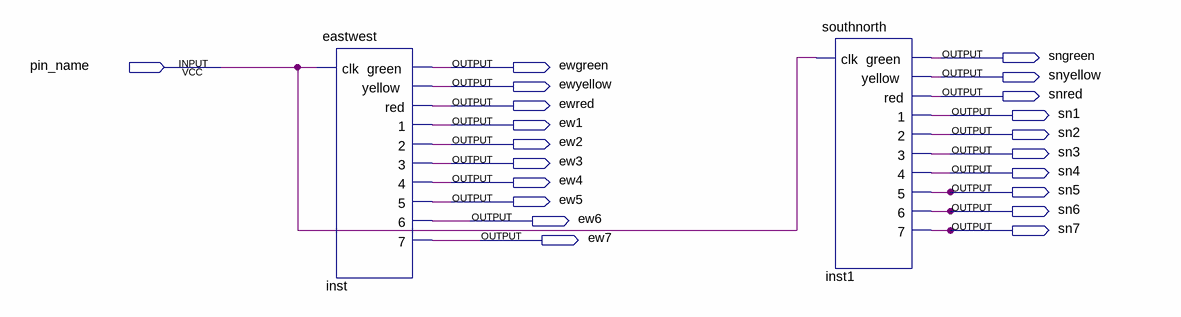
[diagram p0: schematic sheet]
// Quartus schematic jiaotongdeng.bdf as structural Verilog: 2 symbols, 21 pins
module jiaotongdeng (
  input  pin_name,
  output sngreen,
  output ewgreen,
  output snyellow,
  output ewyellow,
  output snred,
  output ewred,
  output sn1,
  output ew1,
  output sn2,
  output ew2,
  output sn3,
  output ew3,
  output sn4,
  output ew4,
  output sn5,
  output ew5,
  output sn6,
  output ew6,
  output sn7,
  output ew7
);

  eastwest inst (
    .clk(pin_name), .green(ewgreen), .yellow(ewyellow), .red(ewred), .\1 (ew1), .\2 (ew2), .\3 (ew3),
    .\4 (ew4), .\5 (ew5), .\6 (ew6), .\7 (ew7));
  southnorth inst1 (
    .clk(pin_name), .green(sngreen), .yellow(snyellow), .red(snred), .\1 (sn1), .\2 (sn2), .\3 (sn3),
    .\4 (sn4), .\5 (sn5), .\6 (sn6), .\7 (sn7));
endmodule
